# EAGLE design BSPD Schematic (with latching fixed - 2-28-2016) (EAGLE 7.2.0)
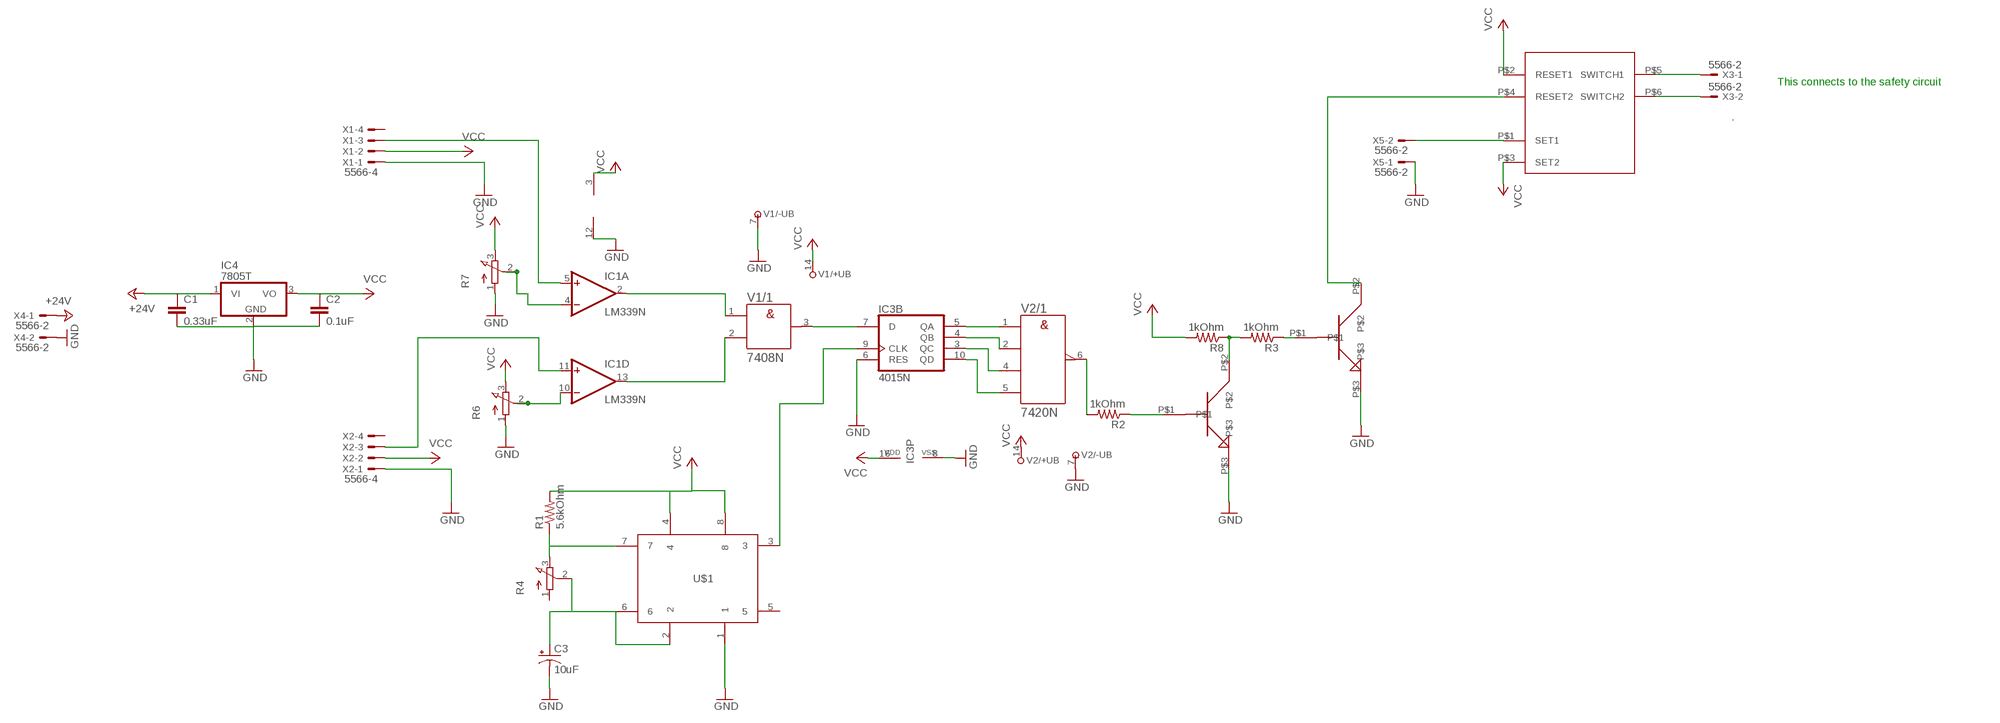
[diagram p0: schematic, sheet 1]

## Parts
C1  0.33uF  CAPPTH3  [CAP-PTH-LARGE]
C2  0.1uF  CAPPTH3  [CAP-PTH-LARGE]
C3  10uF  CPOL-USE2.5-7  [E2,5-7]
IC1  LM339N  [DIL14]
IC3  4015N  [DIL16]
IC4  7805T  [TO220H]
R1  5.6kOhm  RESISTORPTH-1/6W  [1/6W-RES]
R2  1kOhm  RESISTORPTH-1/6W  [1/6W-RES]
R3  1kOhm  RESISTORPTH-1/6W  [1/6W-RES]
R4  3RP/1610N  [3RP/1610N]
R6  3RP/1610N  [3RP/1610N]
R7  3RP/1610N  [3RP/1610N]
R8  1kOhm  RESISTORPTH-1/6W  [1/6W-RES]
U$1  555_TIMER555_TIMER  [DIL08]
U$2  TRANSISTOR_ZTX653THROUGH_HOLE  [TRANSISTOR]
U$3  LATCHING_RELAY_G6CK-1117P-US-DC5  [LATCHING_RELAY_G6CK-1117P-US-DC5]
U$4  TRANSISTOR_ZTX653THROUGH_HOLE  [TRANSISTOR]
V1  7408N  [DIL14]
V2  7420N  [DIL14]
X1  5566-4  [5566-4]
X2  5566-4  [5566-4]
X3  5566-2  [5566-2]
X4  5566-2  [5566-2]
X5  5566-2  [5566-2]

## Nets
+24V: C1.1 IC4.1(VI) X4.1
GND: C1.2 C2.2 C3.- IC1.12(P:GND) IC3.6(B:RES) IC3.8(P:VSS) IC4.2(GND) R6.1(A) R7.1(A) U$1.1 U$2.P$3 U$4.P$3 V1.7(/-UB:-UB) V2.7(/-UB:-UB) X1.1 X2.1 X4.2 X5.1
N$1: IC3.7(B:D) V1.3(/1:Y)
N$2: R2.2 V2.6(/1:Y)
N$3: IC3.4(B:QB) V2.2(/1:B)
N$4: IC3.3(B:QC) V2.4(/1:C)
N$5: IC3.10(B:QD) V2.5(/1:D)
N$6: IC1.13(D:OUT) V1.2(/1:B)
N$7: IC1.2(A:OUT) V1.1(/1:A)
N$8: IC3.9(B:CLK) U$1.3
N$9: IC1.10(D:-IN) R6.2(S)
N$10: IC1.4(A:-IN) R7.2(S)
N$11: C3.+ R4.2(S) U$1.2 U$1.6
N$12: R1.1 R4.3(E) U$1.7
N$13: U$3.P$1(SET1) X5.2
N$14: U$3.P$5(SWITCH1) X3.1
N$15: U$3.P$6(SWITCH2) X3.2
N$16: IC3.5(B:QA) V2.1(/1:A)
N$17: IC1.11(D:+IN) X2.3
N$18: IC1.5(A:+IN) X1.3
N$21: R2.1 U$2.P$1
N$22: R3.1 U$4.P$1
N$23: R3.2 R8.1 U$2.P$2
N$24: U$3.P$4(RESET2) U$4.P$2
VCC: C2.1 IC1.3(P:V+) IC3.16(P:VDD) IC4.3(VO) R1.2 R6.3(E) R7.3(E) R8.2 U$1.4 U$1.8 U$3.P$2(RESET1) U$3.P$3(SET2) V1.14(/+UB:+UB) V2.14(/+UB:+UB) X1.2 X2.2
Unconnected: IC1.1(B:OUT) IC1.6(B:-IN) IC1.7(B:+IN) IC1.8(C:-IN) IC1.9(C:+IN) IC1.14(C:OUT) IC3.1(A:CLK) IC3.2(A:QD) IC3.11(A:QC) IC3.12(A:QB) IC3.13(A:QA) IC3.14(A:RES) IC3.15(A:D) R4.1(A) U$1.5 V1.4(/2:A) V1.5(/2:B) V1.6(/2:Y) V1.8(/3:Y) V1.9(/3:A) V1.10(/3:B) V1.11(/4:Y) V1.12(/4:A) V1.13(/4:B) V2.8(/2:Y) V2.9(/2:A) V2.10(/2:B) V2.12(/2:C) V2.13(/2:D) X1.4 X2.4

## Notes on the sheet
- This connects to the safety circuit

## Library data of the parts
C1 C2 = HyTech 2016:CAP: Capacitor Standard 0603 ceramic capacitor, and 0.1" leaded capacitor.
C3 = rcl:CPOL-US: POLARIZED CAPACITOR, American symbol
IC1 = linear:LM339: Low Power Low Offset Voltage Quad Comparators with open collector; LM139/LM239/LM339/LM2901/LM3302
IC3 = 40xx:4015: Dual 4-bit static SHIFT REGISTER
IC4 = linear:78*: Positive VOLTAGE REGULATOR Source: http://cache.national.com/ds/LM/LM78L05.pdf http://www.fairchildsemi.com/ds/LM/LM7805.pdf
R1-R3 R8 = HyTech 2016:RESISTOR: Resistor Basic schematic elements and footprints for 0603, 1206, and PTH resistors.
R4 R6 R7 = pot:3RP/1610N: 16mm Potentiometer one level Source: http://www.alphapotentiometers.net/html/16mm_pot_2.html
U$1 = HyTech 2016:555_TIMER: Standard 555 Timer Fairchild Semiconductor LM555CN Texas Instruments LM555CN/NOPB
U$2 U$4 = ZTX653:TRANSISTOR_ZTX653: BJT ZTX653
U$3 = Latching_Relay_G6CK-1117P-US-DC5:LATCHING_RELAY_G6CK-1117P-US-DC5: Latching Relay
V1 = 74ttl-din:74*08: Quad 2-input AND gate
V2 = 74ttl-din:74*20: Dual 4-input NAND gate
X1 X2 = con-molex:5566-4: Mini FIT connector 4 pol Source: http://www.molex.com; OC_FARNELL: unknown; OC_NEWARK: unknown
X3-X5 = con-molex:5566-2: Mini FIT connector 2 pol Source: http://www.molex.com; OC_FARNELL: 1822072; OC_NEWARK: unknown

## Net classes
0 default: width 1.524 mm, clearance 0.508 mm

## Board
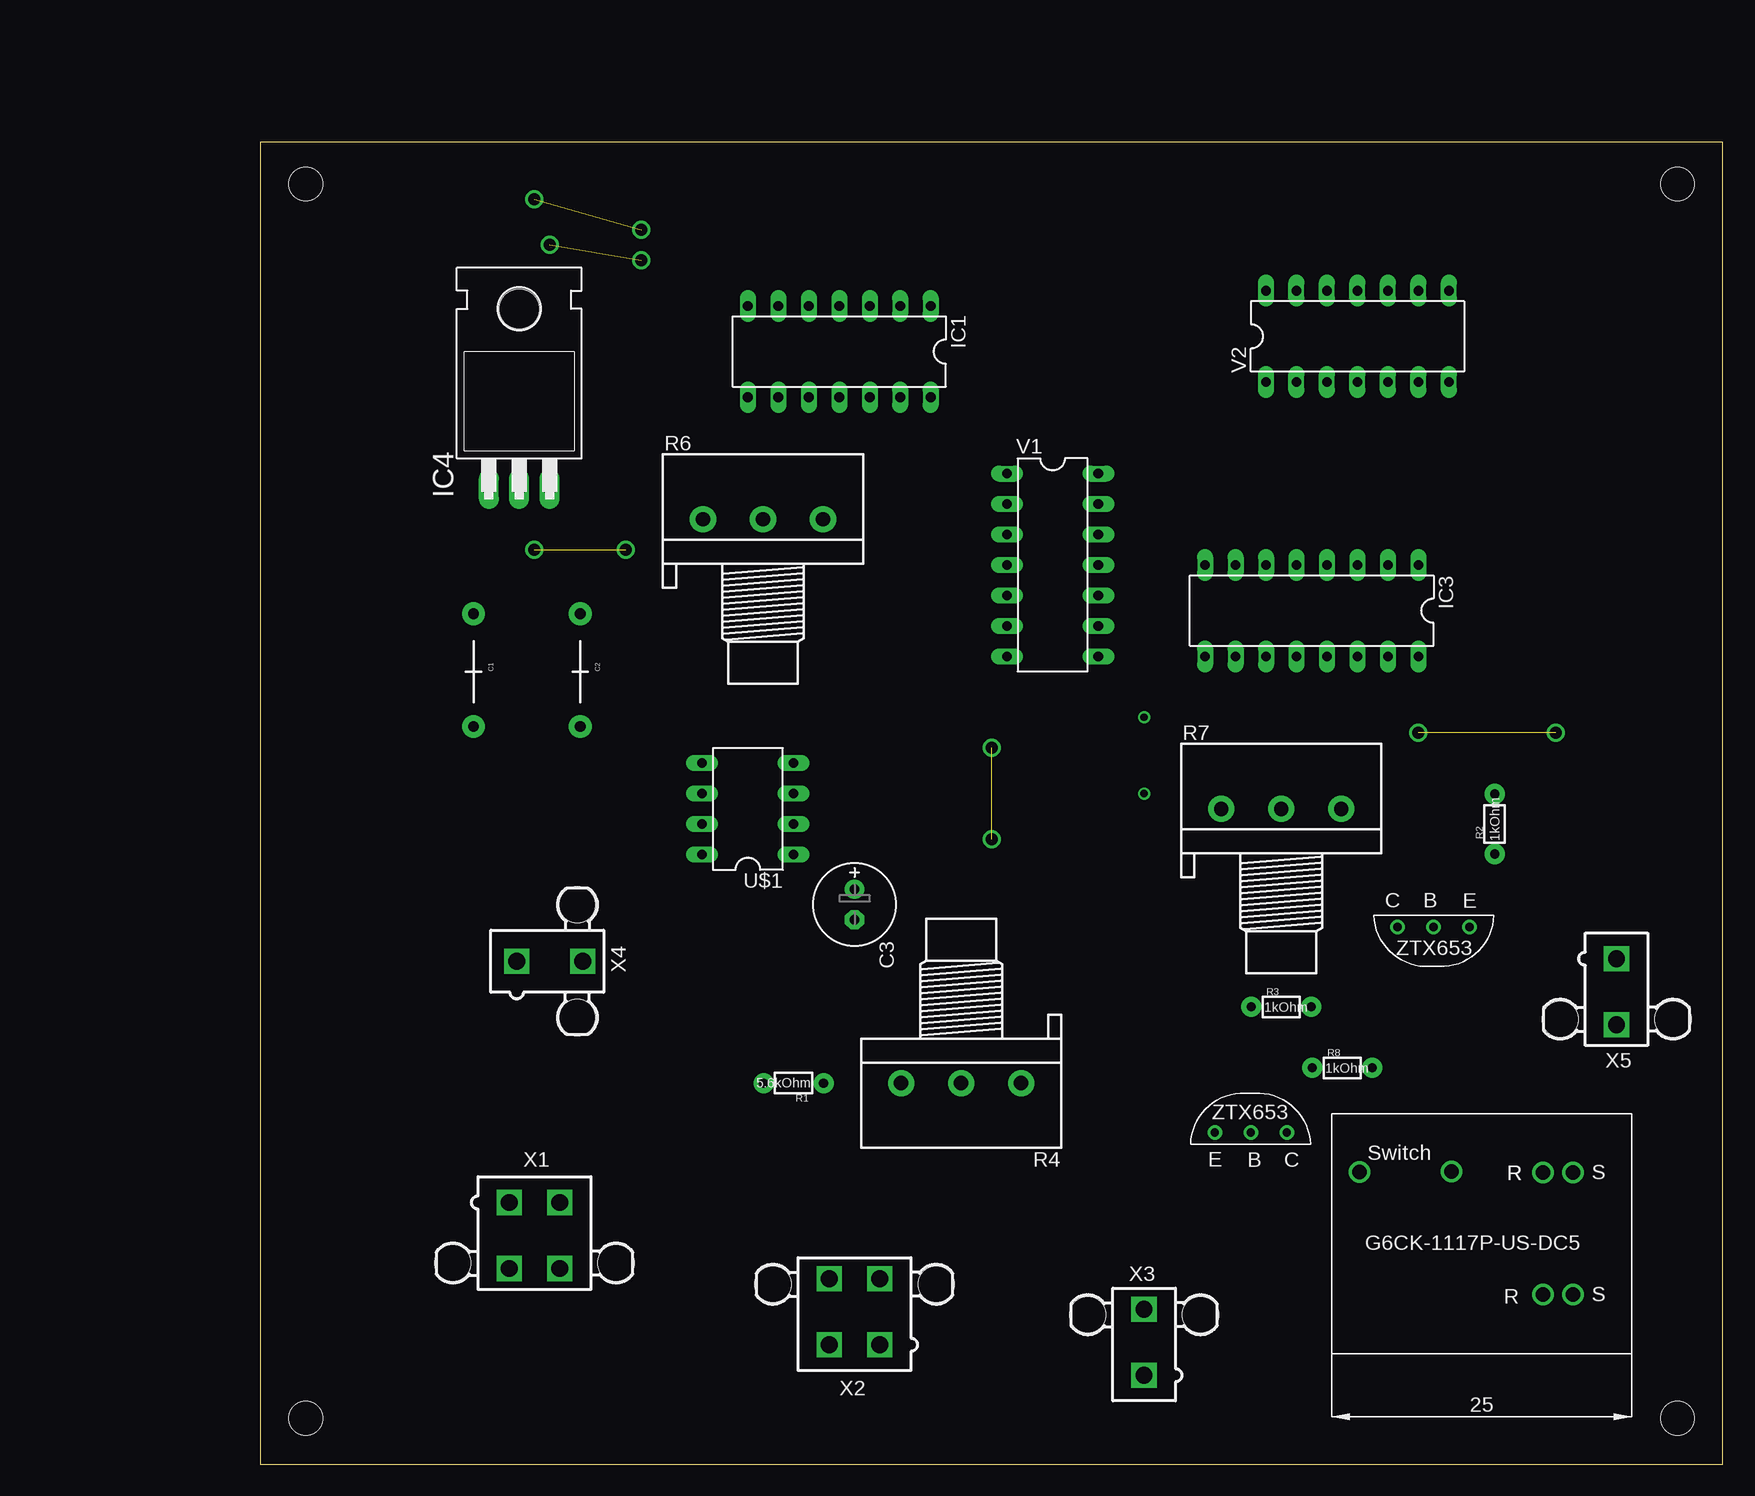
[diagram p1: board, top side]
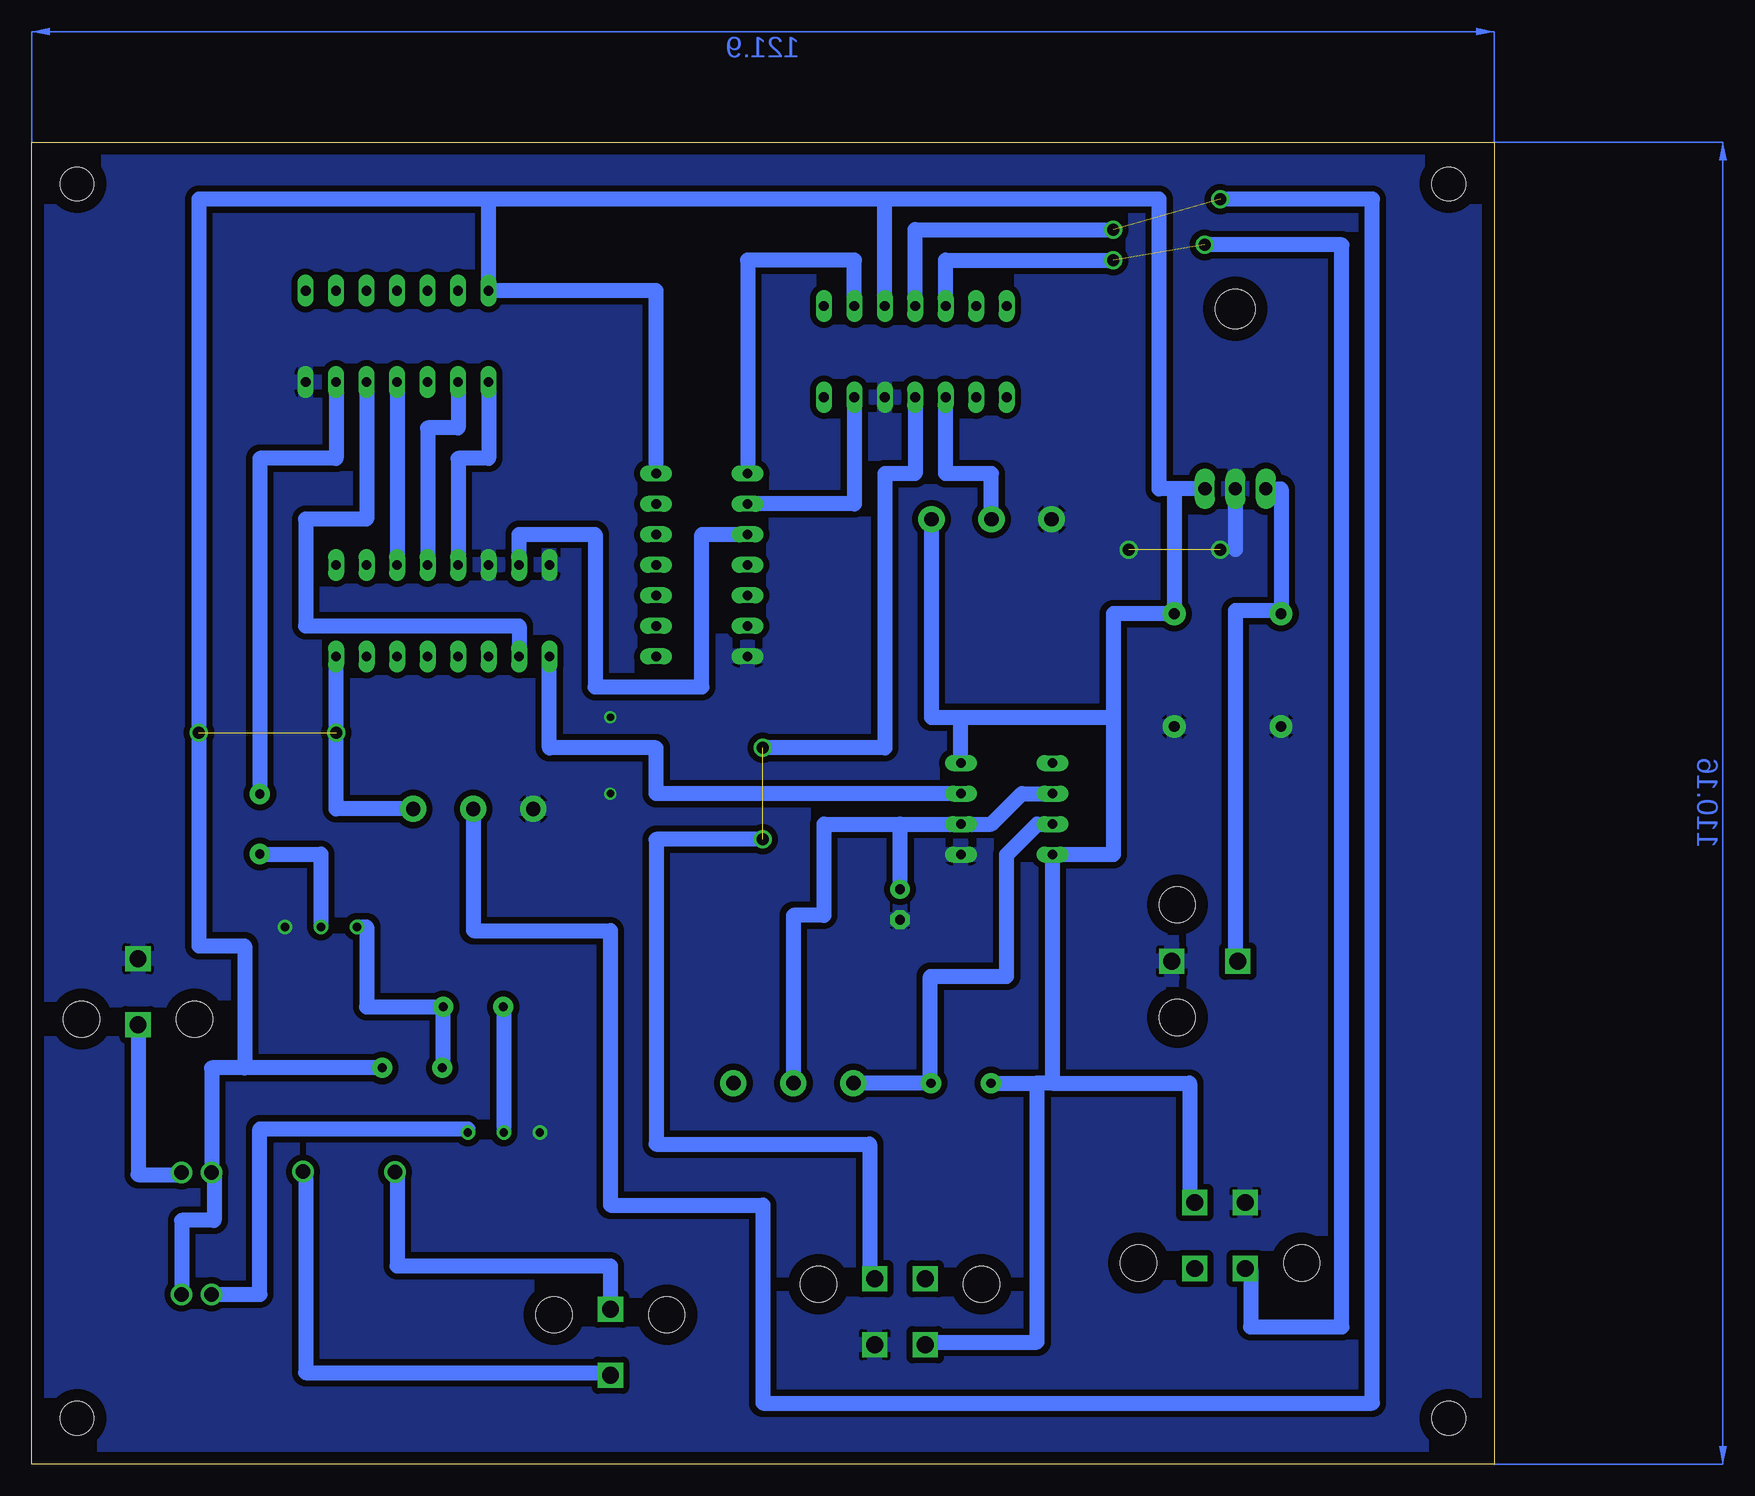
[diagram p2: board, bottom side, seen from below]

Size 121.9 x 110.16 mm. Coordinates in mm from the lower left corner, seen from the top.
Outline: 0,0 121.9,0 121.9,110.16 0,110.16 0,0
Copper layers (1*16): Top 0.035mm / dielectric 1.5mm / Bottom 0.035mm
Design rules "default": minimum track width 10mil, minimum drill 24mil, track to track 8mil, track to pad 8mil, pad to pad 8mil, via to via 8mil, smd to smd 8mil, copper to edge 40mil, drill to drill 8mil, minimum pad ring 10mil, minimum via ring 8mil, stop-mask expansion 4mil, vias tented up to drill 0mil, thermal gap 10mil
Holes 2.8 mm at 118.11,3.81 118.11,106.68 3.81,106.68 3.81,3.81

### Footprints (pad centres in the part's own frame; a part is rotated, then mirrored left to right if it is on the bottom)
CAP-PTH-LARGE = drill 0.9 pad 1.905: 1 -4.826,0; 2 4.572,0
E2,5-7 = drill 0.813 pad 1.6: + -1.27,0 | drill 0.813 pad 1.6 octagon: - 1.27,0
DIL14 = drill 0.813 long: 1 -7.62,-3.81; 2 -5.08,-3.81; 3 -2.54,-3.81; 4 0,-3.81; 5 2.54,-3.81; 6 5.08,-3.81; 7 7.62,-3.81; 8 7.62,3.81; 9 5.08,3.81; 10 2.54,3.81; 11 0,3.81; 12 -2.54,3.81; 13 -5.08,3.81; 14 -7.62,3.81
DIL16 = drill 0.813 long: 1 -8.89,-3.81; 2 -6.35,-3.81; 3 -3.81,-3.81; 4 -1.27,-3.81; 5 1.27,-3.81; 6 3.81,-3.81; 7 6.35,-3.81; 8 8.89,-3.81; 9 8.89,3.81; 10 6.35,3.81; 11 3.81,3.81; 12 1.27,3.81; 13 -1.27,3.81; 14 -3.81,3.81; 15 -6.35,3.81; 16 -8.89,3.81
TO220H = drill 1.118 long: 1 -2.54,-10.16; 2 0,-10.16; 3 2.54,-10.16 | hole 3.302: 0,4.826
1/6W-RES = drill 0.762 pad 1.676: 1 -2.5,0; 2 2.5,0
3RP/1610N = drill 1.2 pad 2.184: 1 -5,0; 2 0,0; 3 5,0
DIL08 = drill 0.813 long: 1 -3.81,-3.81; 2 -1.27,-3.81; 3 1.27,-3.81; 4 3.81,-3.81; 5 3.81,3.81; 6 1.27,3.81; 7 -1.27,3.81; 8 -3.81,3.81
TRANSISTOR = drill 0.7: P$1 0,0.95; P$2 3,0.95; P$3 -3,0.95
LATCHING_RELAY_G6CK-1117P-US-DC5 = drill 1.2: P$1 4.9,4.9; P$2 7.4,4.9; P$3 4.9,15.06; P$4 7.4,15.06; P$5 15.02,4.84; P$6 22.69,4.88
5566-4 = drill 1.4 square: 1 2.1,-2.75; 2 -2.1,-2.75; 3 2.1,2.75; 4 -2.1,2.75 | hole 3: 6.8,2.29; -6.8,2.29
5566-2 = drill 1.4 square: 1 0,-2.75; 2 0,2.75 | hole 3: 4.7,2.29; -4.7,2.29

### Placement (x,y rotation side)
C1  17.78,66.04 270 top
C2  26.67,66.04 270 top
C3  49.53,46.64 270 top
IC1  48.26,92.71 180 top
IC3  87.63,71.12 180 top
IC4  21.59,91.44 0 top
R1  44.45,31.75 180 top
R2  102.87,53.34 90 top
R3  85.09,38.1 0 top
R4  58.42,31.75 180 top
R6  41.91,78.74 0 top
R7  85.09,54.61 0 top
R8  90.17,33.02 0 top
U$1  40.64,54.61 90 top
U$2  97.79,45.72 180 top
U$3  114.3,29.21 180 top
U$4  82.55,26.67 0 top
V1  66.04,74.93 270 top
V2  91.44,93.98 0 top
X1  22.86,19.05 180 top
X2  49.53,12.7 0 top
X3  73.66,10.16 0 top
X4  24.13,41.91 270 top
X5  113.03,39.37 180 top

### Tracks (layer width: path | path; a pad name or v marks a point on that pad's centre or on a via)
+24V
  Bottom 1.27: IC4.1 17.78,81.28 C1.1 17.78,71.12 21.59,71.12 21.59,41.91 X4.1
GND  (via drill 0.6, 1)  (1 unrouted)
  Bottom 1.27: IC4.2 21.59,76.2
  other vias: 73.66,62.23 73.66,55.88 22.86,76.2 30.48,76.2
  pour Bottom: -10.16,114.3 125.73,114.3 125.73,-8.89 -10.16,-7.62
N$1
  Bottom 1.27: IC3.7 81.28,77.47 74.93,77.47 74.93,64.77 66.04,64.77 66.04,77.47 V1.3
N$2
  Bottom 1.27: V2.6 96.52,83.82 102.87,83.82 R2.2
N$3
  Bottom 1.27: V2.2 86.36,86.36 88.9,86.36 IC3.4
N$4
  Bottom 1.27: V2.4 IC3.3
N$5
  Bottom 1.27: V2.5 93.98,78.74 99.06,78.74 99.06,69.85 81.28,69.85 IC3.10
N$6
  Bottom 1.27: IC1.13 53.34,80.01 V1.2
N$7
  Bottom 1.27: IC1.2 53.34,100.33 62.23,100.33 V1.1
N$8
  Bottom 1.27: U$1.3 69.85,55.88 69.85,59.69 78.74,59.69 IC3.9
N$9
  Bottom 1.27: R6.2 41.91,82.55 45.72,82.55 IC1.10
N$10  (via drill 1)  (1 unrouted)
  Bottom 1.27: R7.2 85.09,44.45 73.66,44.45 73.66,21.59 60.96,21.59 60.96,5.08 10.16,5.08 10.16,105.41 v22.86,105.41 | IC1.4 48.26,102.87 v31.75,102.87
N$11
  Bottom 1.27: 49.53,53.34 55.88,53.34 55.88,45.72 58.42,45.72 R4.2 | 49.53,53.34 U$1.2 41.91,53.34 39.37,55.88 U$1.6 | C3.+ 49.53,53.34
N$12
  Bottom 1.27: R4.3 R1.1 46.99,31.75 46.99,40.64 40.64,40.64 40.64,50.8 38.1,53.34 U$1.7
N$13
  Bottom 1.27: X5.2 113.03,24.13 109.4,24.13 U$3.P$1
N$14
  Bottom 1.27: U$3.P$5 99.06,24.37 99.06,7.62 73.66,7.62 X3.1
N$15
  Bottom 1.27: U$3.P$6 91.44,24.33 91.44,16.51 73.66,16.51 X3.2
N$16
  Bottom 1.27: V2.1 83.82,83.82 86.36,83.82 IC3.5
N$17  (via drill 1)  (1 unrouted)
  Bottom 1.27: IC1.11 48.26,82.55 50.8,82.55 50.8,59.69 v60.96,59.69 | X2.3 52.07,15.45 52.07,26.67 69.85,26.67 69.85,52.07 v60.96,52.07
N$18  (via drill 1)  (1 unrouted)
  Bottom 1.27: X1.3 20.32,16.3 20.32,11.43 12.7,11.43 12.7,101.6 v24.13,101.6 | IC1.5 45.72,100.33 v31.75,100.33
N$21
  Bottom 1.27: R2.1 97.79,50.84 U$2.P$1
N$22
  Bottom 1.27: R3.1 82.55,38.1 U$4.P$1
N$23
  Bottom 1.27: R8.1 87.59,33.02 R3.2 93.98,38.1 93.98,44.77 U$2.P$2
N$24
  Bottom 1.27: U$3.P$4 102.87,14.15 102.87,27.94 85.55,27.94 U$4.P$2
VCC  (via drill 1)  (1 unrouted)
  Bottom 1.27: IC4.3 26.67,81.28 | 26.67,81.28 C2.1 31.75,70.87 31.75,62.23 | U$1.8 36.75,50.8 | 31.75,62.23 31.75,50.8 U$1.8 | U$1.4 44.45,62.23 | 44.45,62.23 31.75,62.23 | IC1.3 50.8,105.41 | 50.8,105.41 83.82,105.41 | 26.67,81.28 27.94,81.28 27.94,105.41 50.8,105.41 | R6.3 46.91,62.23 44.45,62.23 | V1.14 69.85,97.79 V2.14 83.82,105.41 | 83.82,105.41 107.95,105.41 v107.95,60.96 107.95,43.18 104.14,43.18 104.14,33.02 | R1.2 38.1,31.75 | 36.83,31.75 25.4,31.75 25.4,21.8 X1.2 | X2.2 47.43,10.16 38.1,10.16 38.1,31.75 | U$1.8 36.83,31.75 | 36.83,31.75 38.1,31.75 | R7.3 96.52,54.61 v96.52,60.96 IC3.16 | 92.71,33.02 R8.2 104.14,33.02 | U$3.P$3 109.4,20.32 106.68,20.32 106.68,24.31 U$3.P$2 106.9,33.02 104.14,33.02
(copper drawn outside any net)
  shapes: Bottom area x2